# Altium project PCB_VHDCI_breakout.PrjPCB
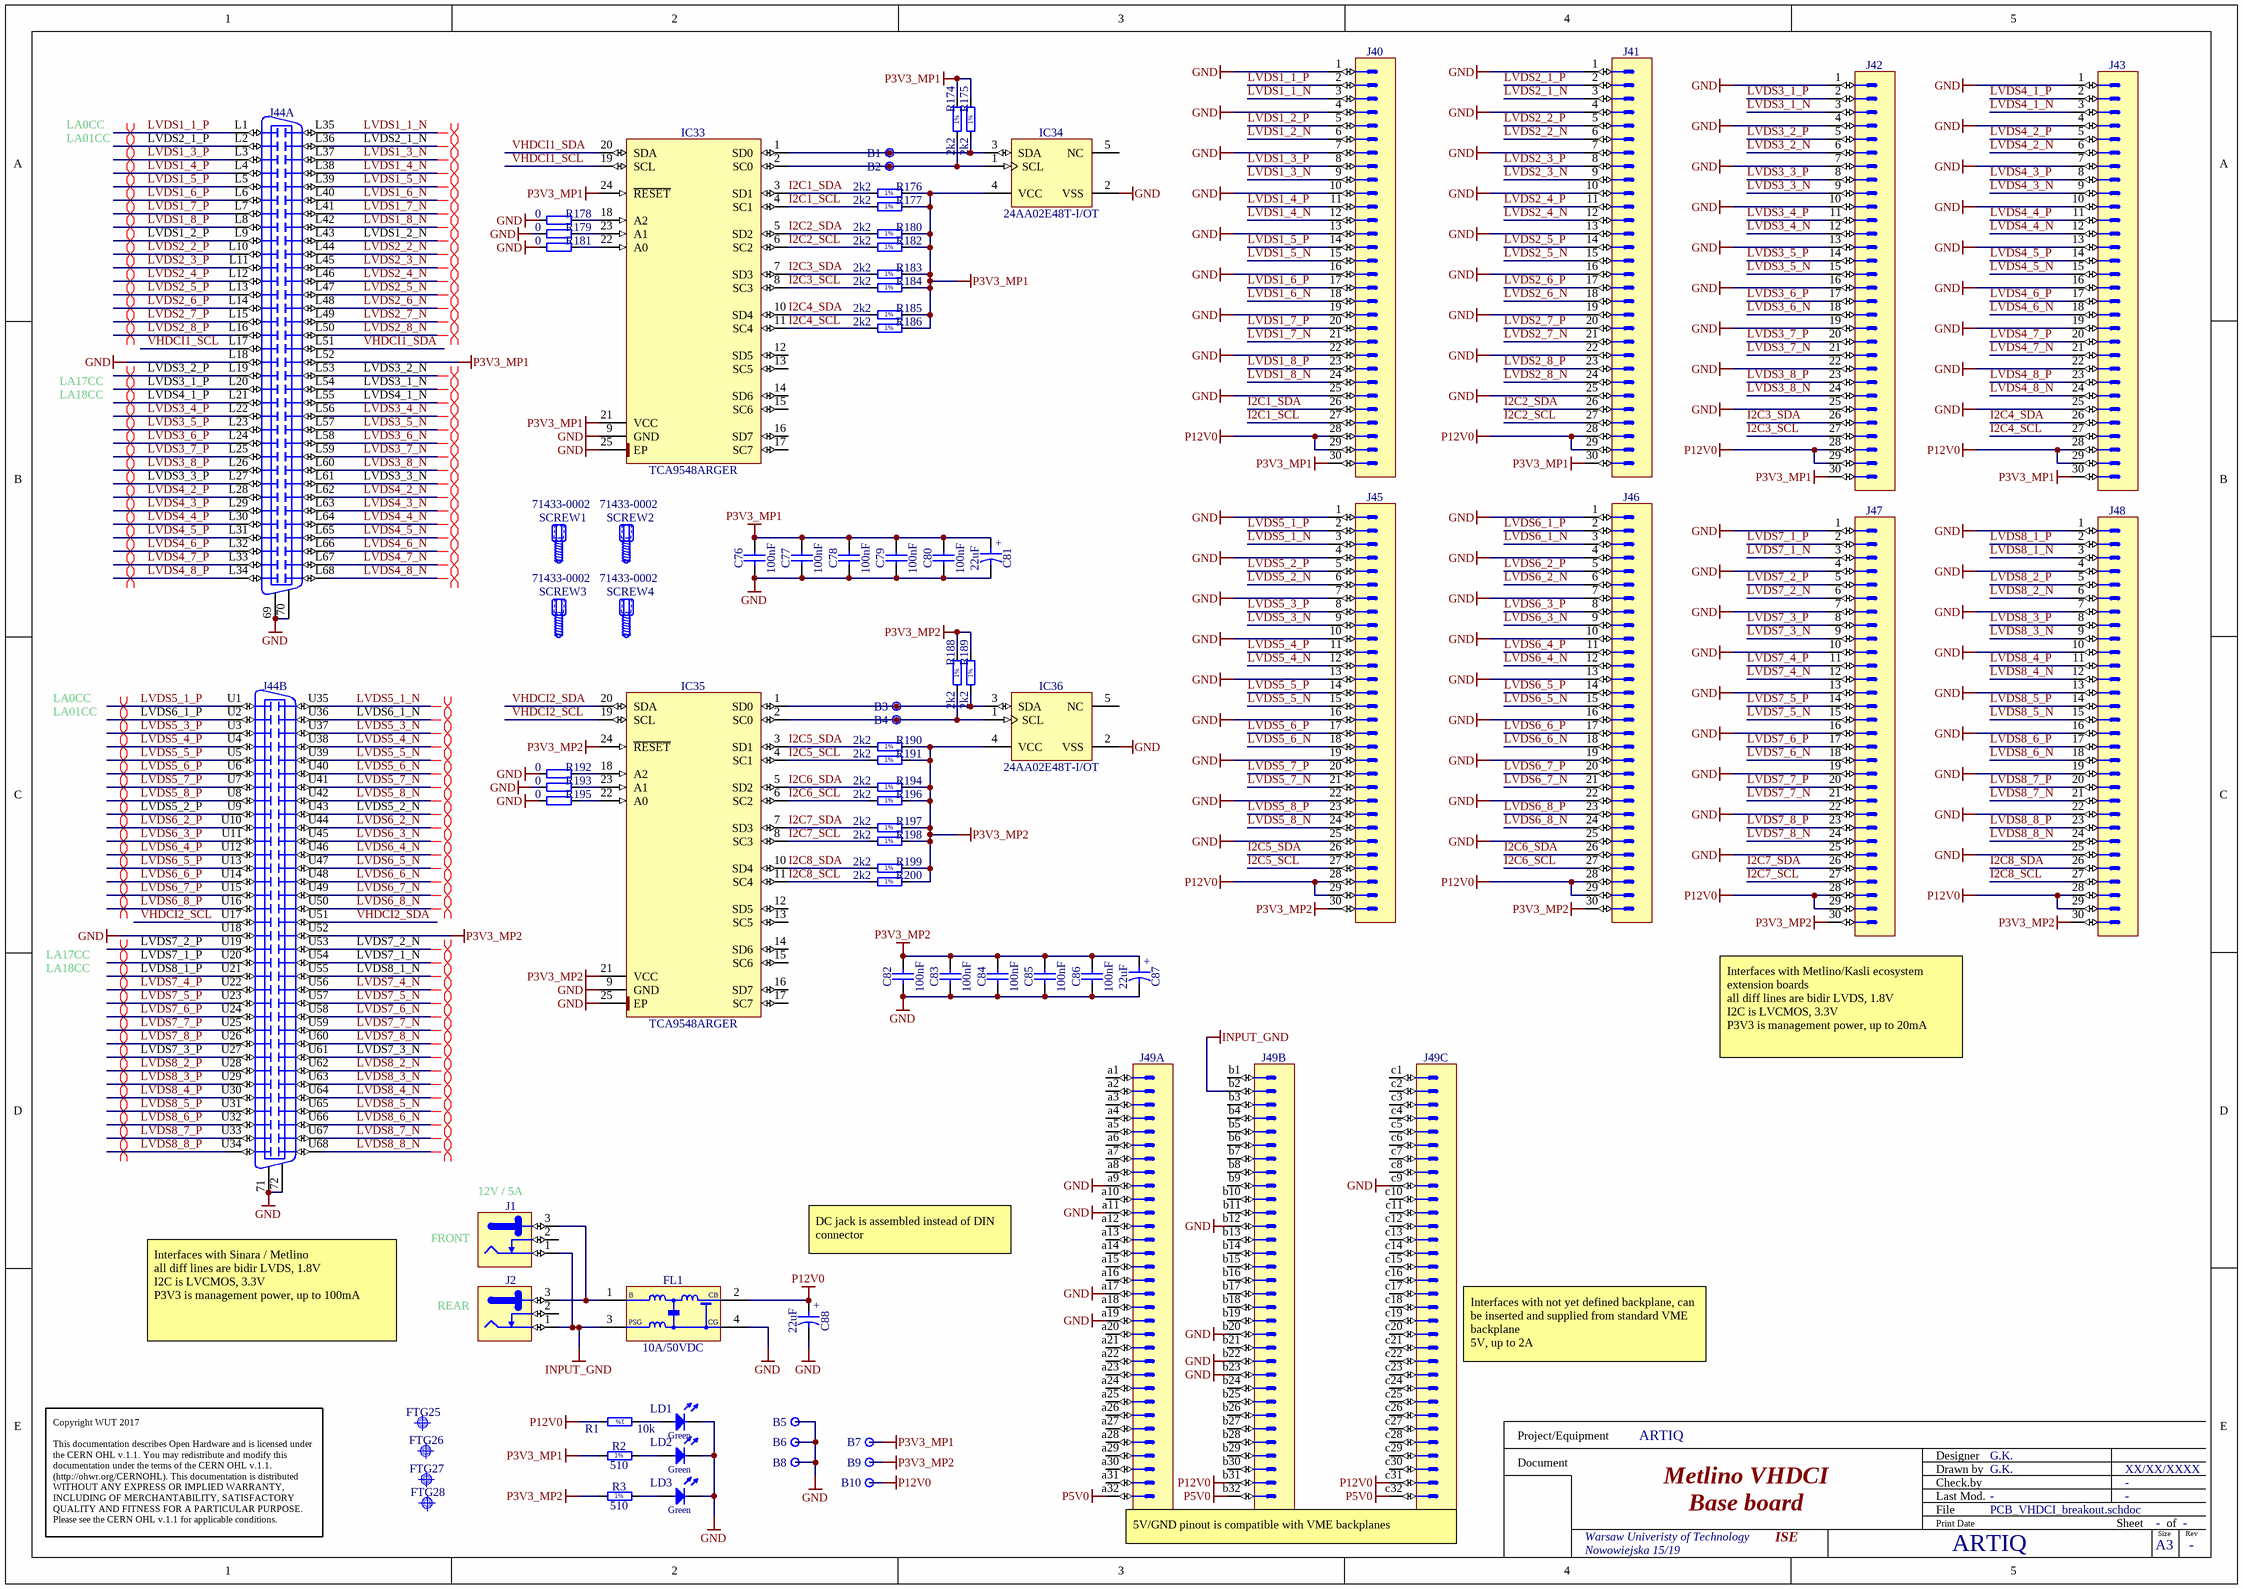
[diagram p0: PCB_VHDCI_breakout.schdoc]
1 sheet, 80 parts. Net scope: global (net labels, ports and power ports of the same name join across sheets).
Board file: PCB_VHDCI_breakout.PCBDOC

## Sheet PCB_VHDCI_breakout.schdoc: Metlino VHDCI
size 420 x 297 mm; Author: G.K.; CompanyName: WUT; DrawnBy: G.K.; Organization: WUT ISE; Address1: Warsaw Univeristy of Technology; Address2: Nowowiejska 15/19; Revision: -; SheetNumber: -; SheetTotal: -; EDA_Number: ARTIQ; Projet: ARTIQ; ModifiedBy: -; CreateDate: XX/XX/XXXX; CheckedDate: -; Title2: Base board; DivGrp: ISE; Designer: G.K.; ModifiedDate: -; ProjectName: ARTIQ

### Parts
B1  Plated Hole  [c130h60]  (value not drawn)
B2  Plated Hole  [c130h60]  (value not drawn)
B3  Plated Hole  [c130h60]  (value not drawn)
B4  Plated Hole  [c130h60]  (value not drawn)
B5  Plated Hole  [c130h60]  (value not drawn)
B6  Plated Hole  [c130h60]  (value not drawn)
B7  Plated Hole  [c130h60]  (value not drawn)
B8  Plated Hole  [c130h60]  (value not drawn)
B9  Plated Hole  [c130h60]  (value not drawn)
B10  Plated Hole  [c130h60]  (value not drawn)
C76  100nF  [CAPC1005X55N]
C77  100nF  [CAPC1005X55N]
C78  100nF  [CAPC1005X55N]
C79  100nF  [CAPC1005X55N]
C80  100nF  [CAPC1005X55N]
C81  22uF  [CAPAE530X540N]
C82  100nF  [CAPC1005X55N]
C83  100nF  [CAPC1005X55N]
C84  100nF  [CAPC1005X55N]
C85  100nF  [CAPC1005X55N]
C86  100nF  [CAPC1005X55N]
C87  22uF  [CAPAE530X540N]
C88  22uF  [CAPAE530X540N]
FL1  10A/50VDC  [FIL_MURATA_BNX02]
FTG25  Use only in PCB  [FIDUCIAL_TOP_C100-200]  (value not drawn)
FTG26  Use only in PCB  [FIDUCIAL_TOP_S100-200]  (value not drawn)
FTG27  Use only in PCB  [FIDUCIAL_TOP_S200-400]  (value not drawn)
FTG28  Use only in PCB  [FIDUCIAL_TOP_S100-200]  (value not drawn)
IC33  TCA9548ARGER  [QFN50P400X400X100-25N-S220]
IC34  24AA02E48T-I/OT  [SOT95P280X145-5N]
IC35  TCA9548ARGER  [QFN50P400X400X100-25N-S220]
IC36  24AA02E48T-I/OT  [SOT95P280X145-5N]
J1  Jack  [SWITCHCRAFT_L712RA]  (value not drawn)
J2  Jack  [SWITCHCRAFT_L712RA]  (value not drawn)
J40  (no value)  [3M_N2530-6002RB]
J41  (no value)  [3M_N2530-6002RB]
J42  (no value)  [3M_N2530-6002RB]
J43  (no value)  [3M_N2530-6002RB]
J44  VHDCI  [MOLEX_74337-0015]  (value not drawn)  (parts A,B of 2)
J45  (no value)  [3M_N2530-6002RB]
J46  (no value)  [3M_N2530-6002RB]
J47  (no value)  [3M_N2530-6002RB]
J48  (no value)  [3M_N2530-6002RB]
J49  DNP  [HARTING_09 03 196 2921]  (value not drawn)  (parts A,B,C of 4)
LD1  Green  [LED_KINGBRIGHT_KPH-1608CGCK]  (value not drawn)
LD2  Green  [LED_KINGBRIGHT_KPH-1608CGCK]  (value not drawn)
LD3  Green  [LED_KINGBRIGHT_KPH-1608CGCK]  (value not drawn)
R1  10k  [RESC1005X40N]
R2  510  [RESC1005X40N]
R3  510  [RESC1005X40N]
R174  2k2  [RESC1005X40N]
R175  2k2  [RESC1005X40N]
R176  2k2  [RESC1005X40N]
R177  2k2  [RESC1005X40N]
R178  0  [RESC1005X40N]
R179  0  [RESC1005X40N]
R180  2k2  [RESC1005X40N]
R181  0  [RESC1005X40N]
R182  2k2  [RESC1005X40N]
R183  2k2  [RESC1005X40N]
R184  2k2  [RESC1005X40N]
R185  2k2  [RESC1005X40N]
R186  2k2  [RESC1005X40N]
R188  2k2  [RESC1005X40N]
R189  2k2  [RESC1005X40N]
R190  2k2  [RESC1005X40N]
R191  2k2  [RESC1005X40N]
R192  0  [RESC1005X40N]
R193  0  [RESC1005X40N]
R194  2k2  [RESC1005X40N]
R195  0  [RESC1005X40N]
R196  2k2  [RESC1005X40N]
R197  2k2  [RESC1005X40N]
R198  2k2  [RESC1005X40N]
R199  2k2  [RESC1005X40N]
R200  2k2  [RESC1005X40N]
SCREW1  71433-0002  [MOLEX_71433-0002]
SCREW2  71433-0002  [MOLEX_71433-0002]
SCREW3  71433-0002  [MOLEX_71433-0002]
SCREW4  71433-0002  [MOLEX_71433-0002]

### Nets
GND: B5.1 B6.1 B8.1 C76.1 C77.1 C78.1 C79.1 C80.1 C81.2 C82.1 C83.1 C84.1 C85.1 C86.1 C87.2 C88.2 FL1.4(CG) IC33.9(GND) IC33.25(EP) IC34.2(VSS) IC35.9(GND) IC35.25(EP) IC36.2(VSS) J40.1 J40.4 J40.7 J40.10 J40.13 J40.16 J40.19 J40.22 J40.25 J41.1 J41.4 J41.7 J41.10 J41.13 J41.16 J41.19 J41.22 J41.25 J42.1 J42.4 J42.7 J42.10 J42.13 J42.16 J42.19 J42.22 J42.25 J43.1 J43.4 J43.7 J43.10 J43.13 J43.16 J43.19 J43.22 J43.25 J44.69 J44.70 J44.71 J44.72 J44.L18 J44.U18 J45.1 J45.4 J45.7 J45.10 J45.13 J45.16 J45.19 J45.22 J45.25 J46.1 J46.4 J46.7 J46.10 J46.13 J46.16 J46.19 J46.22 J46.25 J47.1 J47.4 J47.7 J47.10 J47.13 J47.16 J47.19 J47.22 J47.25 J48.1 J48.4 J48.7 J48.10 J48.13 J48.16 J48.19 J48.22 J48.25 J49.a9 J49.a11 J49.a17 J49.a19 J49.b12 J49.b20 J49.b22 J49.b23 J49.c9 LD1.1(C) LD2.1(C) LD3.1(C) R178.1 R179.1 R181.1 R192.1 R193.1 R195.1
INPUT_GND: FL1.3(PSG) J1.1 J2.1 J49.b2
P3V3_MP1: B7.1 C76.2 C77.2 C78.2 C79.2 C80.2 C81.1 IC33.21(VCC) IC33.24(~{RESET}) IC34.4(VCC) J40.30 J41.30 J42.30 J43.30 J44.L52 R2.1 R174.2 R175.2 R176.2 R177.2 R180.2 R182.2 R183.2 R184.2 R185.2 R186.2
P3V3_MP2: B9.1 C82.2 C83.2 C84.2 C85.2 C86.2 C87.1 IC35.21(VCC) IC35.24(~{RESET}) IC36.4(VCC) J44.U52 J45.30 J46.30 J47.30 J48.30 R3.1 R188.2 R189.2 R190.2 R191.2 R194.2 R196.2 R197.2 R198.2 R199.2 R200.2
P5V0: J49.a32 J49.b32 J49.c32
P12V0: B10.1 C88.1 FL1.2(CB) J40.28 J40.29 J41.28 J41.29 J42.28 J42.29 J43.28 J43.29 J45.28 J45.29 J46.28 J46.29 J47.28 J47.29 J48.28 J48.29 J49.b31 J49.c31 R1.2
I2C1_SCL: IC33.4(SC1) J40.27 R177.1
I2C1_SDA: IC33.3(SD1) J40.26 R176.1
I2C2_SCL: IC33.6(SC2) J41.27 R182.1
I2C2_SDA: IC33.5(SD2) J41.26 R180.1
I2C3_SCL: IC33.8(SC3) J42.27 R184.1
I2C3_SDA: IC33.7(SD3) J42.26 R183.1
I2C4_SCL: IC33.11(SC4) J43.27 R186.1
I2C4_SDA: IC33.10(SD4) J43.26 R185.1
I2C5_SCL: IC35.4(SC1) J45.27 R191.1
I2C5_SDA: IC35.3(SD1) J45.26 R190.1
I2C6_SCL: IC35.6(SC2) J46.27 R196.1
I2C6_SDA: IC35.5(SD2) J46.26 R194.1
I2C7_SCL: IC35.8(SC3) J47.27 R198.1
I2C7_SDA: IC35.7(SD3) J47.26 R197.1
I2C8_SCL: IC35.11(SC4) J48.27 R200.1
I2C8_SDA: IC35.10(SD4) J48.26 R199.1
LVDS1_1_N: J40.3 J44.L35
LVDS1_1_P: J40.2 J44.L1
LVDS1_2_N: J40.6 J44.L43
LVDS1_2_P: J40.5 J44.L9
LVDS1_3_N: J40.9 J44.L37
LVDS1_3_P: J40.8 J44.L3
LVDS1_4_N: J40.12 J44.L38
LVDS1_4_P: J40.11 J44.L4
LVDS1_5_N: J40.15 J44.L39
LVDS1_5_P: J40.14 J44.L5
LVDS1_6_N: J40.18 J44.L40
LVDS1_6_P: J40.17 J44.L6
LVDS1_7_N: J40.21 J44.L41
LVDS1_7_P: J40.20 J44.L7
LVDS1_8_N: J40.24 J44.L42
LVDS1_8_P: J40.23 J44.L8
LVDS2_1_N: J41.3 J44.L36
LVDS2_1_P: J41.2 J44.L2
LVDS2_2_N: J41.6 J44.L44
LVDS2_2_P: J41.5 J44.L10
LVDS2_3_N: J41.9 J44.L45
LVDS2_3_P: J41.8 J44.L11
LVDS2_4_N: J41.12 J44.L46
LVDS2_4_P: J41.11 J44.L12
LVDS2_5_N: J41.15 J44.L47
LVDS2_5_P: J41.14 J44.L13
LVDS2_6_N: J41.18 J44.L48
LVDS2_6_P: J41.17 J44.L14
LVDS2_7_N: J41.21 J44.L49
LVDS2_7_P: J41.20 J44.L15
LVDS2_8_N: J41.24 J44.L50
LVDS2_8_P: J41.23 J44.L16
LVDS3_1_N: J42.3 J44.L54
LVDS3_1_P: J42.2 J44.L20
LVDS3_2_N: J42.6 J44.L53
LVDS3_2_P: J42.5 J44.L19
LVDS3_3_N: J42.9 J44.L61
LVDS3_3_P: J42.8 J44.L27
LVDS3_4_N: J42.12 J44.L56
LVDS3_4_P: J42.11 J44.L22
LVDS3_5_N: J42.15 J44.L57
LVDS3_5_P: J42.14 J44.L23
LVDS3_6_N: J42.18 J44.L58
LVDS3_6_P: J42.17 J44.L24
LVDS3_7_N: J42.21 J44.L59
LVDS3_7_P: J42.20 J44.L25
LVDS3_8_N: J42.24 J44.L60
LVDS3_8_P: J42.23 J44.L26
LVDS4_1_N: J43.3 J44.L55
LVDS4_1_P: J43.2 J44.L21
LVDS4_2_N: J43.6 J44.L62
LVDS4_2_P: J43.5 J44.L28
LVDS4_3_N: J43.9 J44.L63
LVDS4_3_P: J43.8 J44.L29
LVDS4_4_N: J43.12 J44.L64
LVDS4_4_P: J43.11 J44.L30
LVDS4_5_N: J43.15 J44.L65
LVDS4_5_P: J43.14 J44.L31
LVDS4_6_N: J43.18 J44.L66
LVDS4_6_P: J43.17 J44.L32
LVDS4_7_N: J43.21 J44.L67
LVDS4_7_P: J43.20 J44.L33
LVDS4_8_N: J43.24 J44.L68
LVDS4_8_P: J43.23 J44.L34
LVDS5_1_N: J44.U35 J45.3
LVDS5_1_P: J44.U1 J45.2
LVDS5_2_N: J44.U43 J45.6
LVDS5_2_P: J44.U9 J45.5
LVDS5_3_N: J44.U37 J45.9
LVDS5_3_P: J44.U3 J45.8
LVDS5_4_N: J44.U38 J45.12
LVDS5_4_P: J44.U4 J45.11
LVDS5_5_N: J44.U39 J45.15
LVDS5_5_P: J44.U5 J45.14
LVDS5_6_N: J44.U40 J45.18
LVDS5_6_P: J44.U6 J45.17
LVDS5_7_N: J44.U41 J45.21
LVDS5_7_P: J44.U7 J45.20
LVDS5_8_N: J44.U42 J45.24
LVDS5_8_P: J44.U8 J45.23
LVDS6_1_N: J44.U36 J46.3
LVDS6_1_P: J44.U2 J46.2
LVDS6_2_N: J44.U44 J46.6
LVDS6_2_P: J44.U10 J46.5
LVDS6_3_N: J44.U45 J46.9
LVDS6_3_P: J44.U11 J46.8
LVDS6_4_N: J44.U46 J46.12
LVDS6_4_P: J44.U12 J46.11
LVDS6_5_N: J44.U47 J46.15
LVDS6_5_P: J44.U13 J46.14
LVDS6_6_N: J44.U48 J46.18
LVDS6_6_P: J44.U14 J46.17
LVDS6_7_N: J44.U49 J46.21
LVDS6_7_P: J44.U15 J46.20
LVDS6_8_N: J44.U50 J46.24
LVDS6_8_P: J44.U16 J46.23
LVDS7_1_N: J44.U54 J47.3
LVDS7_1_P: J44.U20 J47.2
LVDS7_2_N: J44.U53 J47.6
LVDS7_2_P: J44.U19 J47.5
LVDS7_3_N: J44.U61 J47.9
LVDS7_3_P: J44.U27 J47.8
LVDS7_4_N: J44.U56 J47.12
LVDS7_4_P: J44.U22 J47.11
LVDS7_5_N: J44.U57 J47.15
LVDS7_5_P: J44.U23 J47.14
LVDS7_6_N: J44.U58 J47.18
LVDS7_6_P: J44.U24 J47.17
LVDS7_7_N: J44.U59 J47.21
LVDS7_7_P: J44.U25 J47.20
LVDS7_8_N: J44.U60 J47.24
LVDS7_8_P: J44.U26 J47.23
LVDS8_1_N: J44.U55 J48.3
LVDS8_1_P: J44.U21 J48.2
LVDS8_2_N: J44.U62 J48.6
LVDS8_2_P: J44.U28 J48.5
LVDS8_3_N: J44.U63 J48.9
LVDS8_3_P: J44.U29 J48.8
LVDS8_4_N: J44.U64 J48.12
LVDS8_4_P: J44.U30 J48.11
LVDS8_5_N: J44.U65 J48.15
LVDS8_5_P: J44.U31 J48.14
LVDS8_6_N: J44.U66 J48.18
LVDS8_6_P: J44.U32 J48.17
LVDS8_7_N: J44.U67 J48.21
LVDS8_7_P: J44.U33 J48.20
LVDS8_8_N: J44.U68 J48.24
LVDS8_8_P: J44.U34 J48.23
VHDCI1_SCL: IC33.19(SCL) J44.L17
VHDCI1_SDA: IC33.20(SDA) J44.L51
VHDCI2_SCL: IC35.19(SCL) J44.U17
VHDCI2_SDA: IC35.20(SDA) J44.U51
NetB1_1: B1.1 IC33.1(SD0) IC34.3(SDA) R175.1
NetB2_1: B2.1 IC33.2(SC0) IC34.1(SCL) R174.1
NetB3_1: B3.1 IC35.1(SD0) IC36.3(SDA) R189.1
NetB4_1: B4.1 IC35.2(SC0) IC36.1(SCL) R188.1
NetFL1_1: FL1.1(B) J1.3 J2.3
NetIC33_18: IC33.18(A2) R178.2
NetIC33_22: IC33.22(A0) R181.2
NetIC33_23: IC33.23(A1) R179.2
NetIC35_18: IC35.18(A2) R192.2
NetIC35_22: IC35.22(A0) R195.2
NetIC35_23: IC35.23(A1) R193.2
NetLD1_2: LD1.2(A) R1.1
NetLD2_2: LD2.2(A) R2.2
NetLD3_2: LD3.2(A) R3.2

Not connected (* = marked no-connect by the designer): IC33 12(SD5) 13(SC5) 14(SD6) 15(SC6) 16(SD7) 17(SC7); IC34 5(NC); IC35 12(SD5) 13(SC5) 14(SD6) 15(SC6) 16(SD7) 17(SC7); IC36 5(NC); J1 2; J2 2; J49 a1 a2 a3 a4 a5 a6 a7 a8 a10 a12 a13 a14 a15 a16 a18 a20 a21 a22 a23 a24 a25 a26 a27 a28 a29 a30 a31 b1 b3 b4 b5 b6 b7 b8 b9 b10 b11 b13 b14 b15 b16 b17 b18 b19 b21 b24 b25 b26 b27 b28 b29 b30 c1 c2 c3 c4 c5 c6 c7 c8 c10 c11 c12 c13 c14 c15 c16 c17 c18 c19 c20 c21 c22 c23 c24 c25 c26 c27 c28 c29 c30

### Layout directives
differential pair: LVDS1_1_N, LVDS1_1_P, LVDS1_2_N, LVDS1_2_P, LVDS1_3_N, LVDS1_3_P, LVDS1_4_N, LVDS1_4_P, LVDS1_5_N, LVDS1_5_P, LVDS1_6_N, LVDS1_6_P, LVDS1_7_N, LVDS1_7_P, LVDS1_8_N, LVDS1_8_P, LVDS2_1_N, LVDS2_1_P, LVDS2_2_N, LVDS2_2_P, LVDS2_3_N, LVDS2_3_P, LVDS2_4_N, LVDS2_4_P, LVDS2_5_N, LVDS2_5_P, LVDS2_6_N, LVDS2_6_P, LVDS2_7_N, LVDS2_7_P, LVDS2_8_N, LVDS2_8_P, LVDS3_1_N, LVDS3_1_P, LVDS3_2_N, LVDS3_2_P, LVDS3_3_N, LVDS3_3_P, LVDS3_4_N, LVDS3_4_P, LVDS3_5_N, LVDS3_5_P, LVDS3_6_N, LVDS3_6_P, LVDS3_7_N, LVDS3_7_P, LVDS3_8_N, LVDS3_8_P, LVDS4_1_N, LVDS4_1_P, LVDS4_2_N, LVDS4_2_P, LVDS4_3_N, LVDS4_3_P, LVDS4_4_N, LVDS4_4_P, LVDS4_5_N, LVDS4_5_P, LVDS4_6_N, LVDS4_6_P, LVDS4_7_N, LVDS4_7_P, LVDS4_8_N, LVDS4_8_P, LVDS5_1_N, LVDS5_1_P, LVDS5_2_N, LVDS5_2_P, LVDS5_3_N, LVDS5_3_P, LVDS5_4_N, LVDS5_4_P, LVDS5_5_N, LVDS5_5_P, LVDS5_6_N, LVDS5_6_P, LVDS5_7_N, LVDS5_7_P, LVDS5_8_N, LVDS5_8_P, LVDS6_1_N, LVDS6_1_P, LVDS6_2_N, LVDS6_2_P, LVDS6_3_N, LVDS6_3_P, LVDS6_4_N, LVDS6_4_P, LVDS6_5_N, LVDS6_5_P, LVDS6_6_N, LVDS6_6_P, LVDS6_7_N, LVDS6_7_P, LVDS6_8_N, LVDS6_8_P, LVDS7_1_N, LVDS7_1_P, LVDS7_2_N, LVDS7_2_P, LVDS7_3_N, LVDS7_3_P, LVDS7_4_N, LVDS7_4_P, LVDS7_5_N, LVDS7_5_P, LVDS7_6_N, LVDS7_6_P, LVDS7_7_N, LVDS7_7_P, LVDS7_8_N, LVDS7_8_P, LVDS8_1_N, LVDS8_1_P, LVDS8_2_N, LVDS8_2_P, LVDS8_3_N, LVDS8_3_P, LVDS8_4_N, LVDS8_4_P, LVDS8_5_N, LVDS8_5_P, LVDS8_6_N, LVDS8_6_P, LVDS8_7_N, LVDS8_7_P, LVDS8_8_N, LVDS8_8_P

### Notes on the sheet
- LA0CC
- LA01CC
- LA17CC
- LA18CC
- (near J47) Interfaces with Metlino/Kasli ecosystem extension boards
  all diff lines are bidir LVDS, 1.8V
  I2C is LVCMOS, 3.3V
  P3V3 is management power, up to 20mA
- (near J1) 12V / 5A
- FRONT
- DC jack is assembled instead of DIN connector
- Interfaces with Sinara / Metlino
  all diff lines are bidir LVDS, 1.8V
  I2C is LVCMOS, 3.3V
  P3V3 is management power, up to 100mA
- REAR
- (near J49) Interfaces with not yet defined backplane, can be inserted and supplied from standard VME backplane
  5V, up to 2A
- Copyright WUT 2017
  This documentation describes Open Hardware and is licensed under the CERN OHL v.1.1. You may redistribute and modify this documentation under the terms of the CERN OHL v.1.1. (http://ohwr.org/CERNOHL). This documentation is distributed WITHOUT ANY EXPRESS OR IMPLIED WARRANTY, INCLUDING OF MERCHANTABILITY, SATISFACTORY QUALITY AND FITNESS FOR A PARTICULAR PURPOSE. Please see the CERN OHL v.1.1 for applicable conditions.
- (near J49) 5V/GND pinout is compatible with VME backplanes
- Project/Equipment
- Document
- Designer
- Drawn by
- Check.by
- File
- Last Mod.
- Print Date
- Sheet
- Size
- A3
- of
- Rev
- (in symbol CAE530-540_22UF_16V_20%) +
- (in symbol R0402_2K2_1%_0.0625W_100PPM) 1%
- (in symbol R0402_10K_1%_0.0625W_100PPM) 1%
- (in symbol R0402_510R_1%_0.0625W_100PPM) 1%

### Library data of the parts
B1-B10 = PLATED_HOLE0.6_PAD1.3: Single Terminal Socket; Part Description: Plated Through Hole: Hole Dia.=0.6mm Pad Dia.=1.3mm; Mounted: No; Part Number: PLATED_HOLE0.6_PAD1.3; Component Kind: Standard (No BOM); Component Type: Standard (No BOM); Pin Count: 1; Family: Plated Hole; Socket: No; SMD: No; Sense: No; Status: None; ComponentHeight: 0mm; HelpURL: Undefined; Author: CERN DEM MR; CreateDate: 02.03.2016; LatestRevisionDate: 02.03.2016; PackageDescription: Plated Through Hole: Hole Dia.=0.6mm Pad Dia.=1.3mm
C76-C80 C82-C86 = CC0402_100NF_16V_10%_X5R: Non-polarised capacitor; Part Description: SMD Multilayer Chip Ceramic Capacitor; Manufacturer: GENERIC; Manufacturer1 Part Number: GRM155R61C104KA88D; Voltage: 16V; TC: X5R; Tolerance: ±10%; Part Number: CC0402_100NF_16V_10%_X5R; Component Kind: Standard; Component Type: Standard; Pin Count: 2; Value: 100nF; Status: None; Manufacturer Part Number: CC0402_100NF_16V_10%_X5R; Case: 0402; Mounted: Yes; Socket: No; SMD: Yes; Sense: No; Manufacturer1 Example: MURATA; Manufacturer1 ComponentHeight: 0.55mm; HelpURL: \\cern.ch\dfs\Applications\Altium\Datasheets\CC0402_X5R_MURATA_GRM.pdf; Author: CERN DEM JLC; CreateDate: 10.12.2013; LatestRevisionDate: 10.12.2013
C81 C87 C88 = CAE530-540_22UF_16V_20%: Polarised capacitor; Part Description: Aluminum Electrolytic SMT Capacitor; Manufacturer: PANASONIC; Manufacturer Part Number: EEEFK1C220AR; Voltage: 16V; Tolerance: ±20%; Part Number: CAE530-540_22UF_16V_20%; Component Kind: Standard; Component Type: Standard; Pin Count: 2; Value: 22uF; Status: Not Recommended; Case: B; Mounted: Yes; Socket: No; SMD: Yes; Sense: No; HelpURL: \\cern.ch\dfs\Applications\Altium\Datasheets\CAE_PANASONIC_FK.pdf; Author: CERN DEM JLC; CreateDate: 03.12.2007; LatestRevisionDate: 05.11.2014; ComponentHeight: 5.8mm
FL1 = FIL_MURATA_BNX022-01L: Block Type EMIFIL (LC Combined); Part Description: Block Type EMIFIL (LC Combined) SMD Type, BNX02* Series; Manufacturer: MURATA; Resistance: 0.5R; Part Number: FIL_MURATA_BNX022-01L; Component Kind: Standard; Component Type: Standard; Pin Count: 2; Value: 10A/50VDC; Status: None; Manufacturer Part Number: BNX022-01L; Mounted: Yes; Socket: No; SMD: Yes; Sense: No; ComponentHeight: 3.3mm; HelpURL: \\cern.ch\dfs\Applications\Altium\Datasheets\FIL_MURATA_BNX022-01L.pdf; Author: CERN DEM JLC; CreateDate: 10.10.2012; LatestRevisionDate: 10.10.2012
FTG25 = FIDUCIAL_TARGET_C100-200: Fiducial Target; Part Description: Round Fiducial Target, Top Layer, 1.0mm, Top Solder 2.0mm, Keepout =2.0mm; Mounted: No; Part Number: FIDUCIAL_TARGET_C100-200; Component Kind: Standard (No BOM); Component Type: Standard (No BOM); Pin Count: 1; Family: Fiducial; Socket: No; SMD: Yes; Sense: No; Status: None; ComponentHeight: 0mm; HelpURL: Undefined; Author: CERN DEM JLC; CreateDate: 09.02.2010; LatestRevisionDate: 04.04.2012; PackageDescription: Round Fiducial Target, Top Layer, 1.0mm, Top Solder 2.0mm, Keepout =2.0mm
FTG26 FTG28 = FIDUCIAL_TARGET_S100-200: Fiducial Target; Part Description: Square Fiducial Target, Top Layer, 1.0mm, Top Solder 2.0mm, Keepout =2.0mm; Mounted: No; Part Number: FIDUCIAL_TARGET_S100-200; Component Kind: Standard (No BOM); Component Type: Standard (No BOM); Pin Count: 1; Family: Fiducial; Socket: No; SMD: Yes; Sense: No; Status: None; ComponentHeight: 0mm; HelpURL: Undefined; Author: CERN DEM JLC; CreateDate: 09.02.2010; LatestRevisionDate: 04.04.2012; PackageDescription: Square Fiducial Target, Top Layer, 1.0mm, Top Solder 2.0mm, Keepout =2.0mm
FTG27 = FIDUCIAL_TARGET_S200-400: Fiducial Target; Part Description: Square Fiducial Target, Top Layer, 2.0mm, Top Solder 4.0mm, Keepout =4.0mm; Mounted: No; Part Number: FIDUCIAL_TARGET_S200-400; Component Kind: Standard (No BOM); Component Type: Standard (No BOM); Pin Count: 1; Family: Fiducial; Socket: No; SMD: Yes; Sense: No; Status: None; ComponentHeight: 0mm; HelpURL: Undefined; Author: CERN DEM JLC; CreateDate: 02.06.2008; LatestRevisionDate: 04.04.2012; PackageDescription: Square Fiducial Target, Top Layer, 2.0mm, Top Solder 4.0mm, Keepout =4.0mm
IC33 IC35 = TCA9548ARGER: Low Voltage 8-Channel I2C Switch With Reset; Manufacturer: TEXAS INSTRUMENTS; PressFit: No; Bonding: No; Part Number: TCA9548ARGER; Component Kind: Standard; Component Type: Standard; Device: TCA9548ARGER; PackageDescription: QFN, 0.50mm Pitch, Square; 24 Pin, 4.00mm L X 4.00mm W X 1.00mm H body (w/thermal tab 2.2 X 2.2mm), IPC Medium Density; Part Description: Low Voltage 8-Channel I2C Switch With Reset; Manufacturer Part Number: TCA9548ARGER; Pin Count: 25; Case: QFN24; Mounted: Yes; Socket: No; SMD: Yes; Sense: No; ComponentHeight: 1mm; Author: CERN DEM JLC; HelpURL: \\cern.ch\dfs\Applications\Altium\Datasheets\TCA9548ARGER.pdf; CreateDate: 07.07.2014; LatestRevisionDate: 07.07.2014
IC34 IC36 = 24AA02E48T-I/OT: 1.7V-5.5V, 2K I2C Serial EEPROM With EUI-48 Node Identity; Manufacturer: MICROCHIP TECHNOLOGY; PressFit: No; Bonding: No; Part Number: 24AA02E48T-I/OT; Component Kind: Standard; Component Type: Standard; Device: 24AA02E48T-I/OT; PackageDescription: SOT, 0.95mm pitch; 5 pin, 1.60mm W X 2.90mm L X 1.45mm H body, IPC Medium Density; Part Description: 1.7V-5.5V, 2K I2C Serial EEPROM With EUI-48 Node Identity; Manufacturer Part Number: 24AA02E48T-I/OT; Pin Count: 5; Case: SOT23-5; Mounted: Yes; Socket: No; SMD: Yes; Sense: No; ComponentHeight: 1.45mm; HelpURL: \\cern.ch\dfs\Applications\Altium\Datasheets\24AA02E48T-I-OT.pdf; Author: CERN DEM MR; CreateDate: 31.03.2016; LatestRevisionDate: 31.03.2016
J1 J2 = CON_DC_5A_THT_RA: 24V /3. 5A, 2.1mm Diameter Pin, SMD DC Power Supply Connector With  Break Contact; Part Description: 12V/5A, 2.5mm Diameter Pin, THT DC Power Supply Connector With  Break Contact; Manufacturer: SWITCHCRAFT; Manufacturer Part Number: L712RA; PressFit: No; Part Number: SWITCHCRAFT_L712RA; Component Kind: Standard; Component Type: Standard; Pin Count: 3; Family: Jack; Mounted: Yes; Socket: No; SMD: No; Sense: No; Status: None; ComponentHeight: 11mm; HelpURL: \\cern.ch\dfs\Applications\Altium\Datasheets\LUMBERG_161314.pdf; Author: GK; CreateDate: 15.02.2011; LatestRevisionDate: 20.07.2011
J40-J43 J45-J48 = 3M_N2530-6002RB: Connector 30 Male; Part Description: 30 Contacts - Straight .100'' x .100'' Low Profile Four-Wall Header, 2500 Series; Manufacturer: 3M; PressFit: No; Part Number: 3M_N2530-6002RB; Component Kind: Standard; Component Type: Standard; Pin Count: 30; Family: Header 30; Mounted: Yes; Socket: No; SMD: No; Sense: No; Status: None; Manufacturer Part Number: N2530-6002RB; ComponentHeight: 10.03mm; HelpURL: \\cern.ch\dfs\Applications\Altium\Datasheets\3M_N2530-6002RB.pdf; Author: CERN DEM JLC; CreateDate: 11.02.2009; LatestRevisionDate: 11.08.2009
J44 = MOLEX_74337-0015: Very High Density Cable Interconnect (VHDCI ) 2x68 Female; Part Number: Delivered by GK; Part Description: 2x68 Positions, Pitch 0.8mm, Very Hight Density Right Angle Dual Stacked VHDCI Receptacle; Manufacturer: MOLEX; PressFit: No; Component Kind: Standard; Component Type: Standard; Pin Count: 140; Family: VHDCI; Mounted: Yes; Socket: No; SMD: No; Sense: No; Status: None; Manufacturer Part Number: Delivered by GK; ComponentHeight: 10.78mm; HelpURL: \\cern.ch\dfs\Applications\Altium\Datasheets\MOLEX_74337-0015.pdf; Author: CERN DEM JLC; CreateDate: 30.04.2014; LatestRevisionDate: 30.04.2014
J49 = HARTING_09 03 196 2921: Connector 96abc male (3x32); Part Description: DIN 41612, Type C, 96 Position, Rows a+b+c, Performance level 1, Right Angle Male Connector, Lead 3.0 mm, Pitch 2.54mm; PressFit: No; Part Number: HARTING_09 03 196 2921; Component Kind: Standard; Component Type: Standard; Pin Count: 98; Family: DIN 41612 Type C; Mounted: Yes; Socket: No; SMD: No; Sense: No; Status: None; Manufacturer: HARTING; Manufacturer Part Number: 09 03 196 2921; ComponentHeight: 11mm; HelpURL: \\cern.ch\dfs\Applications\Altium\Datasheets\HARTING_09 03 196 2921.pdf; Author: CERN DEM JLC; CreateDate: 16.04.2008; LatestRevisionDate: 25.02.2013
LD1-LD3 = LED_KINGBRIGHT_KPH-1608CGCK: LED Green 1C 2A; Part Description: SMD Green LED, Case 1.6mmX0.8mm(0603), 0.65mm Thickness; PressFit: No; Bonding: No; Part Number: LED_KINGBRIGHT_KPH-1608CGCK; Component Kind: Standard; Component Type: Standard; Color: Green; PackageDescription: SMT Green LED, Case 0603, Body L 1.6 x W 0.8mm H 0.65mm; Manufacturer: KINGBRIGHT; Manufacturer Part Number: KPH-1608CGCK; Pin Count: 2; Mounted: Yes; Socket: No; SMD: Yes; Sense: No; ComponentHeight: 0.65mm; HelpURL: \\cern.ch\dfs\Applications\Altium\Datasheets\LED_KINGBRIGHT_KPH-1608CGCK.pdf; Author: CERN DEM JLC; CreateDate: 03.07.2017; LatestRevisionDate: 03.07.2017
R1 = R0402_10K_1%_0.0625W_100PPM: Resistor - 1%; Part Description: General Purpose Thick Film Chip Resistor; Manufacturer: GENERIC; Manufacturer1 Part Number: 232270671003L; TC: ±100ppm/°C; Part Number: R0402_10K_1%_0.0625W_100PPM; Component Kind: Standard; Component Type: Standard; Pin Count: 2; Value: 10k; Status: Not recommended; Power: 0.0625W; Tolerance: ±1%; Manufacturer Part Number: R0402_10K_1%_0.0625W_100PPM; Case: 0402; Mounted: Yes; Sense: No; Socket: No; SMD: Yes; Manufacturer1 Example: YAGEO PHYCOMP; Manufacturer1 ComponentHeight: 0.4mm; HelpURL: \\cern.ch\dfs\Applications\Altium\Datasheets\R0402_Phycomp_RC0402.pdf; Author: CERN DEM JLC; CreateDate: 03.12.2007; LatestRevisionDate: 17.10.2012
R2 R3 = R0402_510R_1%_0.0625W_100PPM: Resistor - 1%; Part Description: General Purpose Thick Film Chip Resistor; Manufacturer: GENERIC; Manufacturer1 Part Number: 232270675101L; TC: ±100ppm/°C; Part Number: R0402_510R_1%_0.0625W_100PPM; Component Kind: Standard; Component Type: Standard; Pin Count: 2; Value: 510; Status: Not recommended; Power: 0.0625W; Tolerance: ±1%; Manufacturer Part Number: R0402_510R_1%_0.0625W_100PPM; Case: 0402; Mounted: Yes; Sense: No; Socket: No; SMD: Yes; Manufacturer1 Example: YAGEO PHYCOMP; Manufacturer1 ComponentHeight: 0.4mm; HelpURL: \\cern.ch\dfs\Applications\Altium\Datasheets\R0402_Phycomp_RC0402.pdf; Author: CERN DEM JLC; CreateDate: 03.12.2007; LatestRevisionDate: 17.10.2012
R174-R177 R180 R182-R186 R188-R191 R194 R196-R200 = R0402_2K2_1%_0.0625W_100PPM: Resistor - 1%; Part Description: General Purpose Thick Film Chip Resistor; Manufacturer: GENERIC; Manufacturer1 Part Number: 232270672202L; TC: ±100ppm/°C; Part Number: R0402_2K2_1%_0.0625W_100PPM; Component Kind: Standard; Component Type: Standard; Pin Count: 2; Value: 2k2; Status: Not recommended; Power: 0.0625W; Tolerance: ±1%; Manufacturer Part Number: R0402_2K2_1%_0.0625W_100PPM; Case: 0402; Mounted: Yes; Sense: No; Socket: No; SMD: Yes; Manufacturer1 Example: YAGEO PHYCOMP; Manufacturer1 ComponentHeight: 0.4mm; HelpURL: \\cern.ch\dfs\Applications\Altium\Datasheets\R0402_Phycomp_RC0402.pdf; Author: CERN DEM JLC; CreateDate: 03.12.2007; LatestRevisionDate: 17.10.2012
R178 R179 R181 R192 R193 R195 = R0402_0R_JUMPER: Resistor; Part Description: 1A (0.05R Max DC Resistance) Zero Ohm Jumper; Manufacturer: GENERIC; Manufacturer1 Part Number: 232270591001L; Part Number: R0402_0R_JUMPER; Component Kind: Standard; Component Type: Standard; Pin Count: 2; Value: 0; Status: Not recommended; Manufacturer Part Number: R0402_0R_JUMPER; Case: 0402; Mounted: Yes; Sense: No; Socket: No; SMD: Yes; Manufacturer1 Example: YAGEO PHYCOMP; Manufacturer1 ComponentHeight: 0.4mm; HelpURL: \\cern.ch\dfs\Applications\Altium\Datasheets\R0402_Phycomp_RC0402.pdf; Author: CERN DEM JLC; CreateDate: 03.12.2007; LatestRevisionDate: 17.10.2012
SCREW1-SCREW4 = MECH_VHDCI_screw_lock: VHDCI Female Screw Lock; Part Description: D-Sub Female Screw Locks, Thread Size: Socket MOLEX_71433-0002; Manufacturer: Molex; PressFit: No; Part Number: MOLEX_71433-0002; Component Kind: Standard; Component Type: Mechanical; Pin Count: 0; PackageDescription: D-Sub Female Screw Locks, Thread Size: Socket; Mounted: Yes; Socket: No; SMD: No; Sense: No; Status: None; Value: 71433-0002; Manufacturer Part Number: 71433-0002; ComponentHeight: 5.48mm; HelpURL: \\cern.ch\dfs\Applications\Altium\Datasheets\TYCO_749087-2.pdf; Author: GK; CreateDate: 10.09.2013; LatestRevisionDate: 10.09.2013

## Assembly variants
Standard: not fitted J49